# Altium schematic sheet 95.RS485_RS232.SchDoc
size 420 x 297 mm; Revision: V2.1; Schematic Page Number: 11; Page Number: 41; Check: Default; Schematic Name: RK_NVR_DEMO1_RK3588_LP4/4x_V21; Page Count: 43; Page name: 95.RS485/RS232; Designer: Zhangdz; Schematic Page Count: 99; Revcode: V2.1; DsnPath: E:\Work\SBER\RK3588_SOM\temp\RK_NVR_DEMO1_RK3588_LP4XD200P232SD8_V21_20211228.DSN; SchematicName: RK_NVR_DEMO1_RK3588_LP4/4x_V21; PageName: 95.RS485/RS232; PageSize: A3; TopSchematic: True
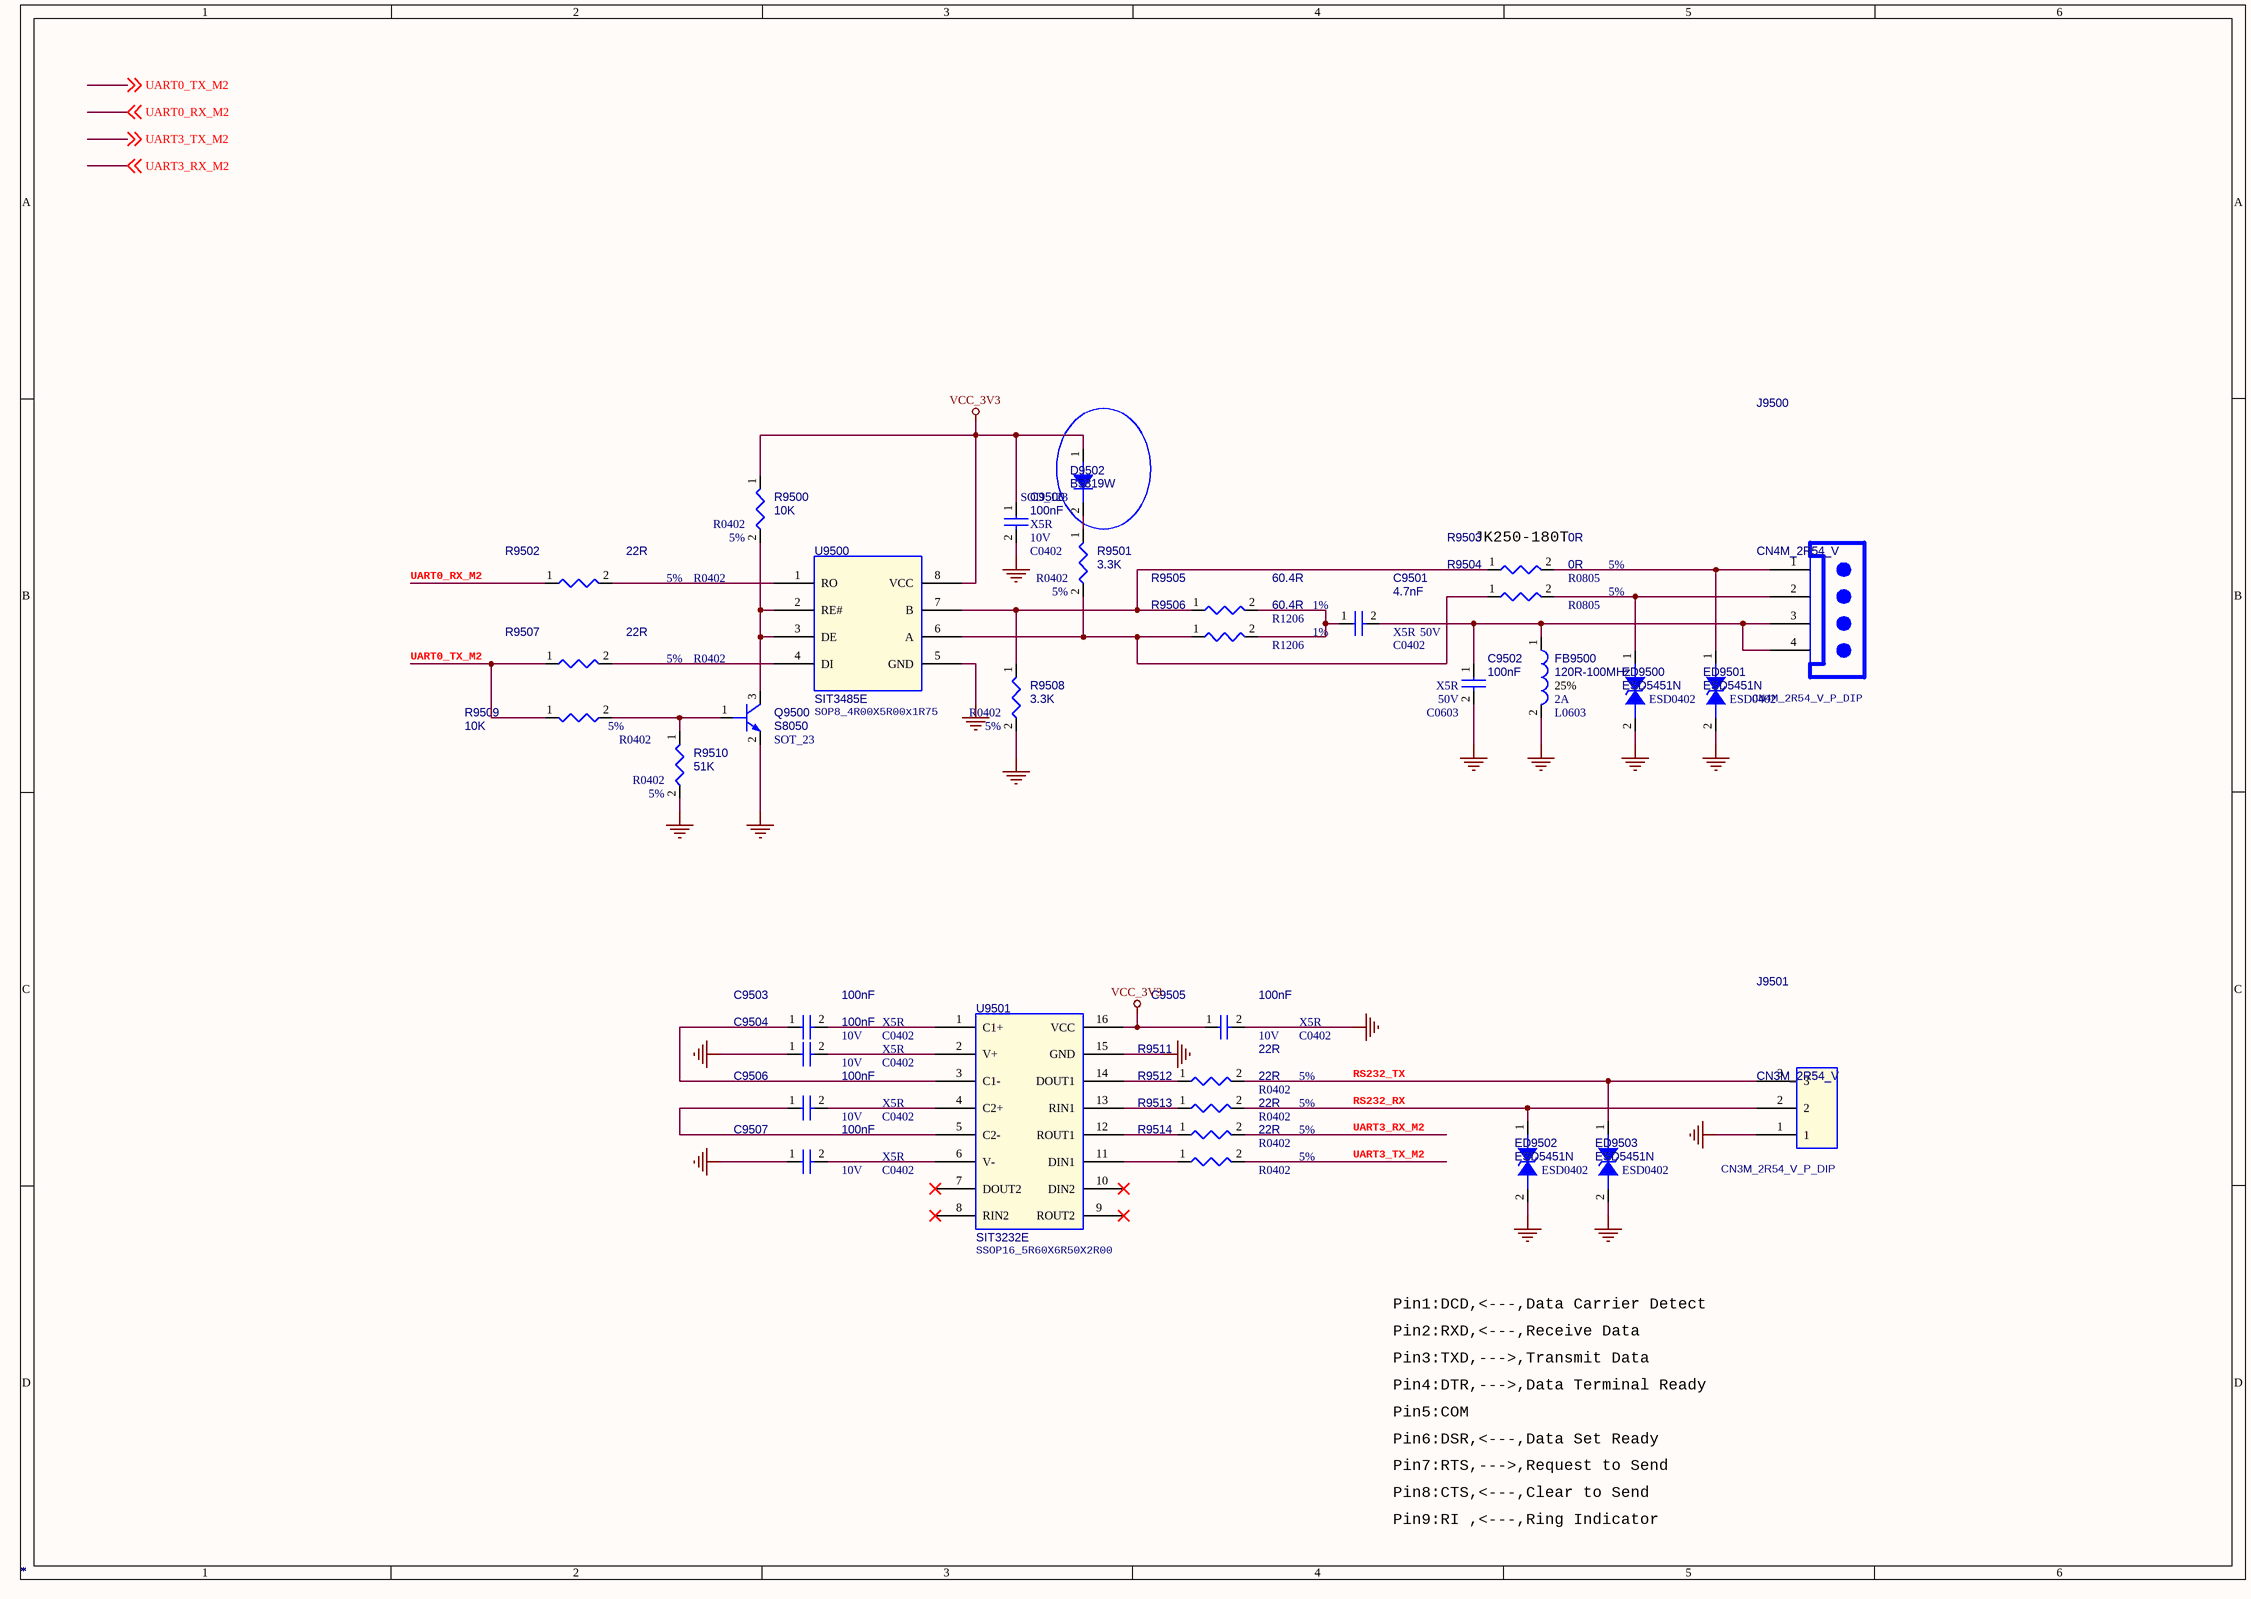
[diagram p0: 95.RS485_RS232.SchDoc]

## Parts
C9500  *  Voltage: 10V  Dielectric: X5R  [C0402]
C9501  *  Voltage: 50V  Dielectric: X5R  [C0402]
C9502  *  Voltage: 50V  Dielectric: X5R  [C0603]
C9503  *  Voltage: 10V  Dielectric: X5R  [C0402]
C9504  *  Voltage: 10V  Dielectric: X5R  [C0402]
C9505  *  Voltage: 10V  Dielectric: X5R  [C0402]
C9506  *  Voltage: 10V  Dielectric: X5R  [C0402]
C9507  *  Voltage: 10V  Dielectric: X5R  [C0402]
D9502  *  [SOD_123]
ED9500  *  [ESD0402]
ED9501  *  [ESD0402]
ED9502  *  [ESD0402]
ED9503  *  [ESD0402]
FB9500  *  Tolerance: 25%  Irms: 2A  [L0603]
J9500  *  [CN4M_2R54_V_P_DIP]
J9501  *  PCB Footprint: CN3M_2R54_V_P_DIP  [DIP3_1X3_2R54]
Q9500  *  [SOT_23]
R9500  *  Tolerance: 5%  [R0402]
R9501  *  Tolerance: 5%  [R0402]
R9502  *  Tolerance: 5%  [R0402]
R9503  *  PCB Footprint: R0805  Tolerance: 5%  [R0402]
R9504  *  PCB Footprint: R0805  Tolerance: 5%  [R0402]
R9505  *  PCB Footprint: R1206  Tolerance: 1%  [R0402]
R9506  *  PCB Footprint: R1206  Tolerance: 1%  [R0402]
R9507  *  Tolerance: 5%  [R0402]
R9508  *  Tolerance: 5%  [R0402]
R9509  *  Tolerance: 5%  [R0402]
R9510  *  Tolerance: 5%  [R0402]
R9511  *  Tolerance: 5%  [R0402]
R9512  *  Tolerance: 5%  [R0402]
R9513  *  Tolerance: 5%  [R0402]
R9514  *  Tolerance: 5%  [R0402]
U9500  *  [SOP8_4R00X5R00x1R75]
U9501  *  PCB Footprint: SSOP16_5R60X6R50X2R00  [SOP16]

## Nets
GND: C9500.2 C9502.2 C9504.1 C9505.2 C9507.1 ED9500.2 ED9501.2 ED9502.2 ED9503.2 FB9500.2 J9501.1 Q9500.2(EMITTER) R9508.2 R9510.2 U9500.5(GND) U9501.15(GND)
VCC_3V3: C9500.1 C9505.1 D9502.1(A) R9500.1 U9500.8(VCC) U9501.16(VCC)
RS232_RX: ED9502.1 J9501.2 R9512.2
RS232_TX: ED9503.1 J9501.3 R9511.2
UART0_RX_M2: R9502.1 ; off-sheet UART0_RX_M2
UART0_TX_M2: R9507.1 R9509.1 ; off-sheet UART0_TX_M2
UART3_RX_M2: R9513.2 ; off-sheet UART3_RX_M2
UART3_TX_M2: R9514.2 ; off-sheet UART3_TX_M2
NetC9501_1: C9501.1 R9505.2 R9506.2
NetC9501_2: C9501.2 C9502.1 FB9500.1 J9500.3(TX) J9500.4(3V3)
NetC9503_1: C9503.1 U9501.3(C1-)
NetC9503_2: C9503.2 U9501.1(C1+)
NetC9504_2: C9504.2 U9501.2(V+)
NetC9506_1: C9506.1 U9501.5(C2-)
NetC9506_2: C9506.2 U9501.4(C2+)
NetC9507_2: C9507.2 U9501.6(V-)
NetD9502_2: D9502.2(K) R9501.1
NetED9500_1: ED9500.1 J9500.2(RX) R9504.2
NetED9501_1: ED9501.1 J9500.1(GND) R9503.2
NetQ9500_1: Q9500.1(BASE) R9509.2 R9510.1
NetQ9500_3: Q9500.3(COLLECTOR) R9500.2 U9500.2(RE#) U9500.3(DE)
NetR9501_2: R9501.2 R9504.1 R9506.1 U9500.6(A)
NetR9502_2: R9502.2 U9500.1(RO)
NetR9503_1: R9503.1 R9505.1 R9508.1 U9500.7(B)
NetR9507_2: R9507.2 U9500.4(DI)
NetR9511_1: R9511.1 U9501.14(DOUT1)
NetR9512_1: R9512.1 U9501.13(RIN1)
NetR9513_1: R9513.1 U9501.12(ROUT1)
NetR9514_1: R9514.1 U9501.11(DIN1)

Not connected (* = marked no-connect by the designer): U9501 7(DOUT2)* 8(RIN2)* 9(ROUT2)* 10(DIN2)*

## Notes on the sheet
- (near R9503) JK250-180T
- Pin1:DCD,<---,Data Carrier Detect
- Pin2:RXD,<---,Receive Data
- Pin3:TXD,--->,Transmit Data
- Pin4:DTR,--->,Data Terminal Ready
- Pin5:COM
- Pin6:DSR,<---,Data Set Ready
- Pin7:RTS,--->,Request to Send
- Pin8:CTS,<---,Clear to Send
- Pin9:RI ,<---,Ring Indicator

## Library data of the parts
C9500 = CAP NP: cap,100.00nF,+/-10%,10V,X5R,C0402; Part Reference: C9500; Manufacturer PN: C1005X5R1A104K050BA; Manufacturer: TDK; Value: 100nF; C_Voltage: 6.3V; Tolerance: 10%; Priority: A; Number: 37; PCB Footprint: C0402; Created by: JJJ; Part Type: C0402; RK PN: C1005X5R1A104K050BA
C9501 = CAP NP: cap,4.70nF,+/-10%,50V,X5R,C0402; Part Reference: C9501; Manufacturer PN: C1005X5R1H472K050BA; Manufacturer: TDK; Value: 4.7nF; Tolerance: 10%; Priority: A; PCB Footprint: C0402; Created by: JJJ; C_Voltage: 50V; Part Type: C0402; RK PN: C1005X5R1H472K050BA
C9502 = CAP NP: cap,100.00nF,+/-10%,50V,X5R,C0603; Part Reference: C9502; Manufacturer: TDK; Value: 100nF; RK PN: C1608X5R1H104K080AA; Priority: A; C_Voltage: 6.3V; Tolerance: 10%; PCB Footprint: C0603; Part Type: C0603; Manufacturer PN: C1608X5R1H104K080AA; Created by: JJJ
C9503 = CAP NP: cap,100.00nF,+/-10%,10V,X5R,C0402; Part Reference: C9503; Manufacturer: TDK; Value: 100nF; Number: 37; RK PN: C1005X5R1A104K050BA; Priority: A; Tolerance: 10%; C_Voltage: 6.3V; PCB Footprint: C0402; Part Type: C0402; Manufacturer PN: C1005X5R1A104K050BA; Created by: JJJ
C9504 = CAP NP: cap,100.00nF,+/-10%,10V,X5R,C0402; Part Reference: C9504; Manufacturer: TDK; Value: 100nF; Number: 37; RK PN: C1005X5R1A104K050BA; Priority: A; Tolerance: 10%; C_Voltage: 6.3V; PCB Footprint: C0402; Part Type: C0402; Manufacturer PN: C1005X5R1A104K050BA; Created by: JJJ
C9505 = CAP NP: cap,100.00nF,+/-10%,10V,X5R,C0402; Part Reference: C9505; Manufacturer: TDK; Value: 100nF; Number: 37; RK PN: C1005X5R1A104K050BA; Priority: A; Tolerance: 10%; C_Voltage: 6.3V; PCB Footprint: C0402; Part Type: C0402; Manufacturer PN: C1005X5R1A104K050BA; Created by: JJJ
C9506 = CAP NP: cap,100.00nF,+/-10%,10V,X5R,C0402; Part Reference: C9506; Manufacturer: TDK; Value: 100nF; Number: 37; RK PN: C1005X5R1A104K050BA; Priority: A; Tolerance: 10%; C_Voltage: 6.3V; PCB Footprint: C0402; Part Type: C0402; Manufacturer PN: C1005X5R1A104K050BA; Created by: JJJ
C9507 = CAP NP: cap,100.00nF,+/-10%,10V,X5R,C0402; Part Reference: C9507; Manufacturer PN: C1005X5R1A104K050BA; Manufacturer: TDK; Value: 100nF; C_Voltage: 6.3V; Tolerance: 10%; Priority: A; Number: 37; PCB Footprint: C0402; Created by: JJJ; Part Type: C0402; RK PN: C1005X5R1A104K050BA
D9502 = DIODE: Schottky BarrierЈ¬B5819W SOD-123; Part Reference: D9502; Manufacturer: і¤µз; Value: B5819W; Priority: A; PCB Footprint: SOD_123; RK PN: B5819W; Part Type: Schottky rectifier; Manufacturer PN: B5819W; Created by: JJJ
ED9500 = DIODE BI_DIR TRIG: 1-Line, Bi-directional, Transient Voltage Suppressors.17.5pF.; Part Reference: ED9500; Manufacturer: WillSemi(О¤¶ы°лµјМе); Value: ESD5451N; Priority: A; PCB Footprint: ESD0402; Created by: JJJ; Manufacturer PN: ESD5451N; Part Type: ESD_TVS; RK PN: ESD5451N
ED9501 = DIODE BI_DIR TRIG: 1-Line, Bi-directional, Transient Voltage Suppressors.17.5pF.; Part Reference: ED9501; Manufacturer: WillSemi(О¤¶ы°лµјМе); Value: ESD5451N; Priority: A; PCB Footprint: ESD0402; Created by: JJJ; Manufacturer PN: ESD5451N; Part Type: ESD_TVS; RK PN: ESD5451N
ED9502 = DIODE BI_DIR TRIG: 1-Line, Bi-directional, Transient Voltage Suppressors.17.5pF.; Part Reference: ED9502; Manufacturer: WillSemi(О¤¶ы°лµјМе); Value: ESD5451N; Priority: A; PCB Footprint: ESD0402; Created by: JJJ; Manufacturer PN: ESD5451N; Part Type: ESD_TVS; RK PN: ESD5451N
ED9503 = DIODE BI_DIR TRIG: 1-Line, Bi-directional, Transient Voltage Suppressors.17.5pF.; Part Reference: ED9503; Manufacturer: WillSemi(О¤¶ы°лµјМе); Value: ESD5451N; Priority: A; PCB Footprint: ESD0402; Created by: JJJ; Manufacturer PN: ESD5451N; Part Type: ESD_TVS; RK PN: ESD5451N
FB9500 = BEAD: BEAD,120R@100MHz,current=2000mA,0603; Part Reference: FB9500; Manufacturer PN: BLM18KG121TN1; Manufacturer: Murata; DC Resistor: 0.030ohm; Value: 120R-100MHz; Priority: L; PCB Footprint: L0603; Created by: DZS; Part Type: BEAD; RK PN: BLM18KG121TN1
J9500 = CON4_0: Part Reference: J9500; Value: CN4M_2R54_V; PCB Footprint: CN4M_2R54_V_P_DIP
J9501 = CON3_1X3: µҐЕЕ3PINЈЁјдѕа2.54mmЈ©І»ґш·А»¤ЗЅµДІеХл; Part Reference: J9501; Manufacturer Part Number: CON3M_1X3_2R54_V; Manufacturer: НъїЖґп; Value: CN3M_2R54_V; Priority: A; Created by: JJJ; Part Type: Header; RK PN: CON3M_1X3_2R54_V
Q9500 = NPN: S8050,SOT23; Part Reference: Q9500; Manufacturer PN: S8050_SOT23; Manufacturer: і¤µз; Pc: 0.3W; Vceo: 25V; Ic: 0.5A; Priority: A; PCB Footprint: SOT_23; Value: S8050; Created by: JJJ; Part Type: NPN; RK PN: S8050
R9500 = RESISTOR_Dup1: НЁУГєсД¤µзЧи,10K,+/-5%,R0402,1/16W.; Part Reference: R9500; Manufacturer PN: RC0402JR-0710KL; Manufacturer: YAGEO; Wattage: 1/16W; Priority: A; PCB Footprint: R0402; Value: 10K; Created by: YTL; Part Type: НЁУГєсД¤µзЧи; RK PN: RC0402JR-0710KL
R9501 = RESISTOR_Dup1: НЁУГєсД¤µзЧи,3K3,+/-5%,R0402,1/16W.; Part Reference: R9501; Manufacturer PN: RC0402JR-073K3L; Manufacturer: YAGEO; Value: 3.3K; Wattage: 1/16W; Priority: A; PCB Footprint: R0402; Created by: YTL; Part Type: НЁУГєсД¤µзЧи; RK PN: RC0402JR-073K3L
R9502 = RESISTOR_Dup1: НЁУГєсД¤µзЧи,22R,+/-5%,R0402,1/16W.; Part Reference: R9502; Manufacturer: YAGEO; RK PN: RC0402JR-0722RL; Priority: A; Wattage: 1/16W; PCB Footprint: R0402; Value: 22R; Part Type: НЁУГєсД¤µзЧи; Manufacturer PN: RC0402JR-0722RL; Created by: YTL
R9503 = RESISTOR_Dup1: НЁУГєсД¤µзЧи,0R,+/-5%,R0805,1/8W.; Part Reference: R9503; Manufacturer PN: RC0805JR-070RL; Manufacturer: YAGEO; Wattage: 1/8W; Priority: A; Value: 0R; Created by: YTL; Part Type: НЁУГєсД¤µзЧи; RK PN: RC0805JR-070RL
R9504 = RESISTOR_Dup1: НЁУГєсД¤µзЧи,0R,+/-5%,R0805,1/8W.; Part Reference: R9504; Manufacturer: YAGEO; RK PN: RC0805JR-070RL; Priority: A; Wattage: 1/8W; Value: 0R; Part Type: НЁУГєсД¤µзЧи; Manufacturer PN: RC0805JR-070RL; Created by: YTL
R9505 = RESISTOR_Dup1: НЁУГєсД¤µзЧи,60R4,+/-1%,R1206,1/4W.; Part Reference: R9505; Manufacturer PN: RC1206FR-0760R4L; Manufacturer: YAGEO; Value: 60.4R; Wattage: 1/4W; Priority: A; Created by: YTL; Part Type: НЁУГєсД¤µзЧи; RK PN: RC1206FR-0760R4L
R9506 = RESISTOR_Dup1: НЁУГєсД¤µзЧи,60R4,+/-1%,R1206,1/4W.; Part Reference: R9506; Manufacturer: YAGEO; Value: 60.4R; RK PN: RC1206FR-0760R4L; Priority: A; Wattage: 1/4W; Part Type: НЁУГєсД¤µзЧи; Manufacturer PN: RC1206FR-0760R4L; Created by: YTL
R9507 = RESISTOR_Dup1: НЁУГєсД¤µзЧи,22R,+/-5%,R0402,1/16W.; Part Reference: R9507; Manufacturer: YAGEO; RK PN: RC0402JR-0722RL; Priority: A; Wattage: 1/16W; PCB Footprint: R0402; Value: 22R; Part Type: НЁУГєсД¤µзЧи; Manufacturer PN: RC0402JR-0722RL; Created by: YTL
R9508 = RESISTOR_Dup1: НЁУГєсД¤µзЧи,3K3,+/-5%,R0402,1/16W.; Part Reference: R9508; Manufacturer PN: RC0402JR-073K3L; Manufacturer: YAGEO; Value: 3.3K; Wattage: 1/16W; Priority: A; PCB Footprint: R0402; Created by: YTL; Part Type: НЁУГєсД¤µзЧи; RK PN: RC0402JR-073K3L
R9509 = RESISTOR_Dup1: НЁУГєсД¤µзЧи,10K,+/-5%,R0402,1/16W.; Part Reference: R9509; Manufacturer PN: RC0402JR-0710KL; Manufacturer: YAGEO; Wattage: 1/16W; Priority: A; PCB Footprint: R0402; Value: 10K; Created by: YTL; Part Type: НЁУГєсД¤µзЧи; RK PN: RC0402JR-0710KL
R9510 = RESISTOR_Dup1: НЁУГєсД¤µзЧи,51K,+/-5%,R0402,1/16W.; Part Reference: R9510; Manufacturer PN: RC0402JR-0751KL; Manufacturer: YAGEO; Wattage: 1/16W; Priority: A; PCB Footprint: R0402; Value: 51K; Created by: YTL; Part Type: НЁУГєсД¤µзЧи; RK PN: RC0402JR-0751KL
R9511 = RESISTOR_Dup1: НЁУГєсД¤µзЧи,22R,+/-5%,R0402,1/16W.; Part Reference: R9511; Manufacturer: YAGEO; RK PN: RC0402JR-0722RL; Priority: A; Wattage: 1/16W; PCB Footprint: R0402; Value: 22R; Part Type: НЁУГєсД¤µзЧи; Manufacturer PN: RC0402JR-0722RL; Created by: YTL
R9512 = RESISTOR_Dup1: НЁУГєсД¤µзЧи,22R,+/-5%,R0402,1/16W.; Part Reference: R9512; Manufacturer PN: RC0402JR-0722RL; Manufacturer: YAGEO; Wattage: 1/16W; Priority: A; PCB Footprint: R0402; Value: 22R; Created by: YTL; Part Type: НЁУГєсД¤µзЧи; RK PN: RC0402JR-0722RL
R9513 = RESISTOR_Dup1: НЁУГєсД¤µзЧи,22R,+/-5%,R0402,1/16W.; Part Reference: R9513; Manufacturer: YAGEO; RK PN: RC0402JR-0722RL; Priority: A; Wattage: 1/16W; PCB Footprint: R0402; Value: 22R; Part Type: НЁУГєсД¤µзЧи; Manufacturer PN: RC0402JR-0722RL; Created by: YTL
R9514 = RESISTOR_Dup1: НЁУГєсД¤µзЧи,22R,+/-5%,R0402,1/16W.; Part Reference: R9514; Manufacturer: YAGEO; RK PN: RC0402JR-0722RL; Priority: A; Wattage: 1/16W; PCB Footprint: R0402; Value: 22R; Part Type: НЁУГєсД¤µзЧи; Manufacturer PN: RC0402JR-0722RL; Created by: YTL
U9500 = MAX3485_0: Part Reference: U9500; Value: SIT3485E; PCB Footprint: SOP8_4R00X5R00x1R75
U9501 = MAX3232/SIT3232E: Part Reference: U9501; Value: SIT3232E